# EAGLE schematic Hoverboard JC2015.7.31 (EAGLE 9.6.2)
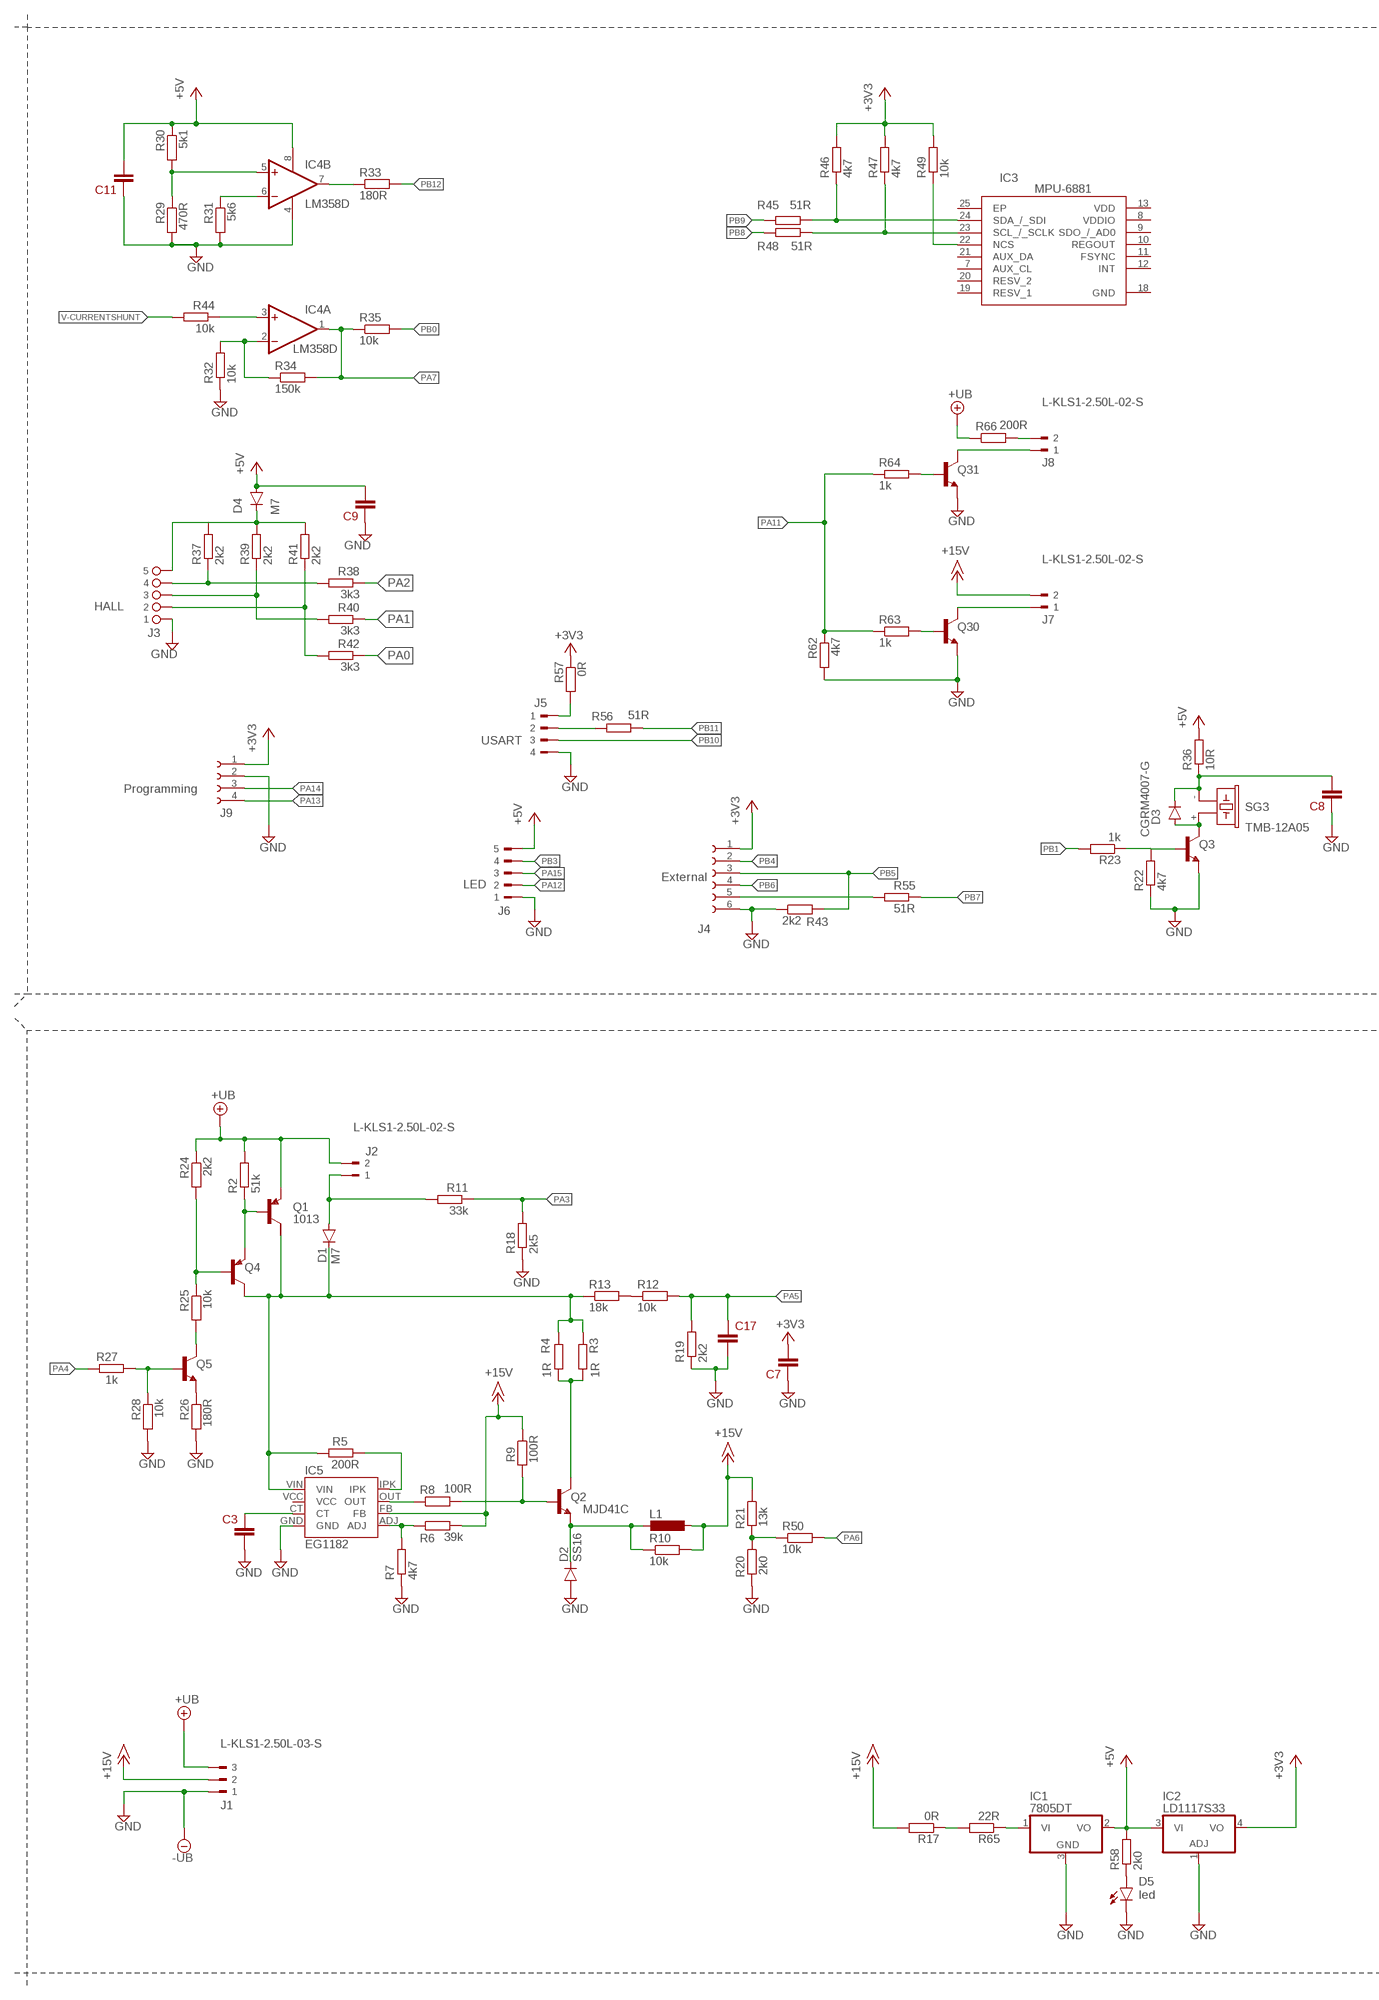
[diagram p0: schematic, sheet 1, part 1 of 2]
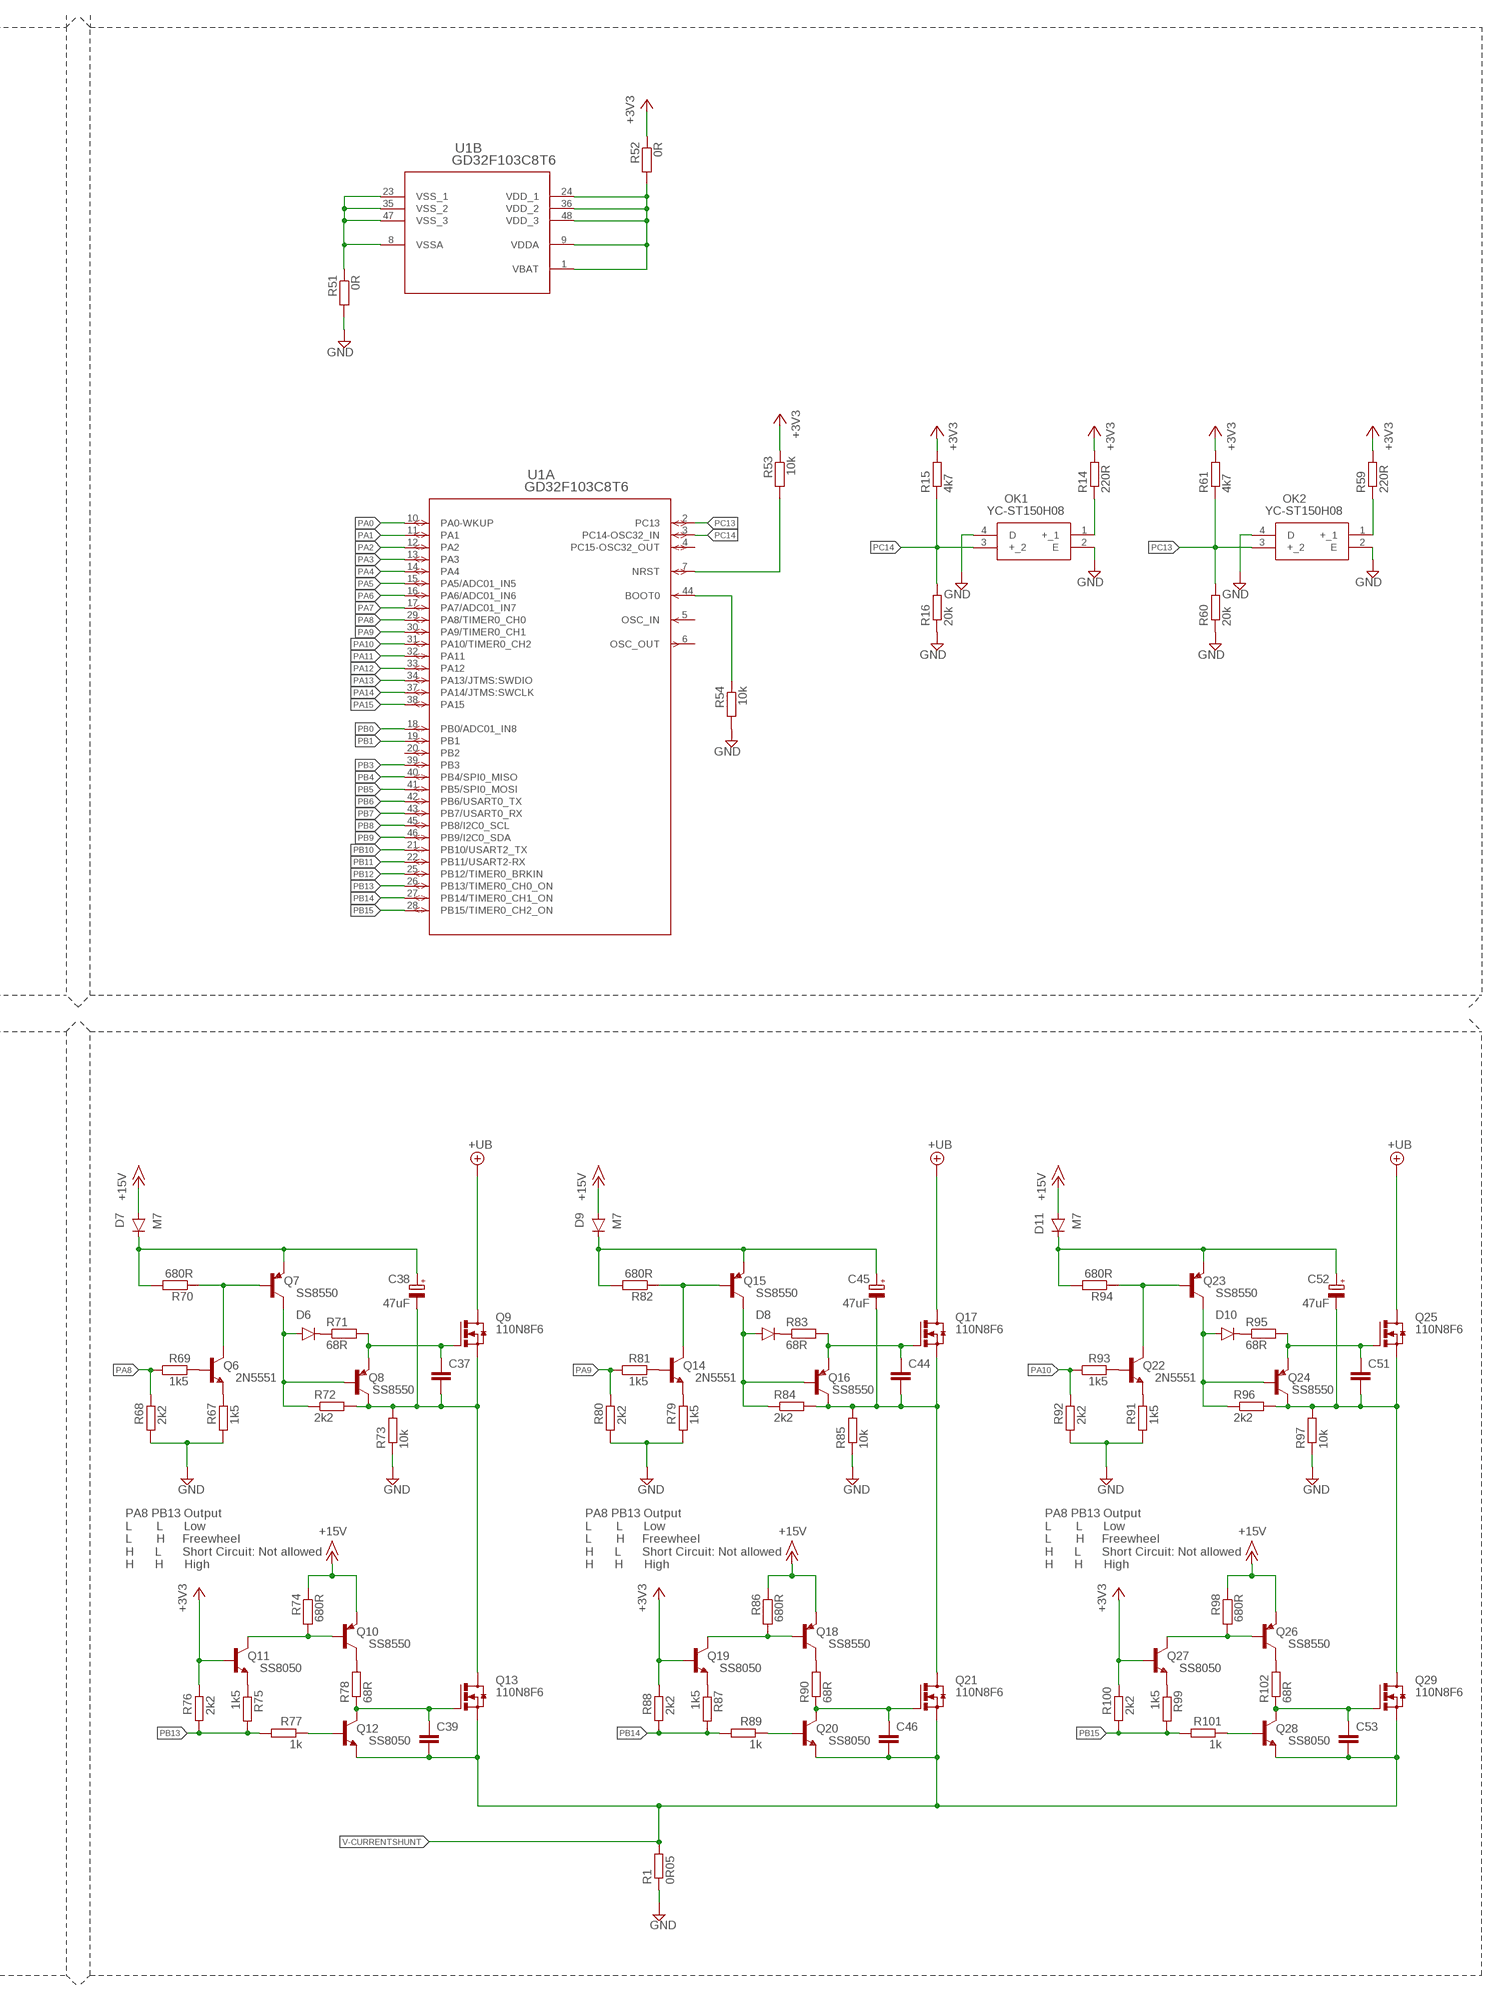
[diagram p1: schematic, sheet 1, part 2 of 2]

## Parts
C3  C-EUC0603  [C0603]
C7  C-EUC0603  [C0603]
C8  C-EUC0603  [C0603]
C9  C-EUC0603  [C0603]
C11  C-EUC0603  [C0603]
C17  C-EUC0603  [C0603]
C37  C-EUC0603  [C0603]
C38  47uF  CPOL-EUE1.8-4  [E1,8-4]
C39  C-EUC0603  [C0603]
C44  C-EUC0603  [C0603]
C45  47uF  CPOL-EUE1.8-4  [E1,8-4]
C46  C-EUC0603  [C0603]
C51  C-EUC0603  [C0603]
C52  47uF  CPOL-EUE1.8-4  [E1,8-4]
C53  C-EUC0603  [C0603]
D1  M7  CGRM4007-G  [SOD-123_MINI-SMA]
D2  SS16  DIODE-DO-214AC  [DO-214AC]
D3  CGRM4007-G  [SOD-123_MINI-SMA]
D4  M7  CGRM4007-G  [SOD-123_MINI-SMA]
D5  led  LG_T679-E1F1-1  [PLCC2]
D6  DIODE-MINIMELF  [MINIMELF]
D7  M7  CGRM4007-G  [SOD-123_MINI-SMA]
D8  DIODE-MINIMELF  [MINIMELF]
D9  M7  CGRM4007-G  [SOD-123_MINI-SMA]
D10  DIODE-MINIMELF  [MINIMELF]
D11  M7  CGRM4007-G  [SOD-123_MINI-SMA]
IC1  7805DT  [TO252]
IC2  LD1117S33  317EMP  [SOT223]
IC3  MPU-6881  [QFN40P300X300X95-25N]
IC4  LM358D  [SO08]
IC5  EG1182  [EG1182]
J1  L-KLS1-2.50L-03-S  [L-KLS1-2.50L-03-S]
J2  L-KLS1-2.50L-02-S  [L-KLS1-2.50L-02-S]
J3  HALL  ST05-1  [ST05-1]
J4  External  FE06-1  [FE06-1]
J5  USART  L-KLS1-2.50L-04-S  [L-KLS1-2.50L-04-S]
J6  LED  L-KLS1-2.50L-05-S  [L-KLS1-2.50L-05-S]
J7  L-KLS1-2.50L-02-S  [L-KLS1-2.50L-02-S]
J8  L-KLS1-2.50L-02-S  [L-KLS1-2.50L-02-S]
J9  Programming  FE04-1  [FE04-1]
L1  L-EU6000-XXX-RC  [6000-XXXX-RC]
OK1  YC-ST150H08  [YC-ST150H08]
OK2  YC-ST150H08  [YC-ST150H08]
Q1  1013  PNP-TRANSISTIOR-2COLSOT89  [SOT89]
Q2  MJD41C  MJD31C  [DPAK]
Q3  MMBT5551LT1-NPN-SOT23-BEC  [SOT23-BEC]
Q4  MMBT540LT1-PNP-SOT23-BEC  [SOT23-BEC]
Q5  MMBT5551LT1-NPN-SOT23-BEC  [SOT23-BEC]
Q6  2N5551  MMBT5551LT1-NPN-SOT23-BEC  [SOT23-BEC]
Q7  SS8550  MMBTA56-SOT23  [SOT23]
Q8  SS8550  MMBTA56-SOT23  [SOT23]
Q9  110N8F6  P110N8F6  [TO220BV]
Q10  SS8550  MMBTA56-SOT23  [SOT23]
Q11  SS8050  MMBT5551LT1-NPN-SOT23-BEC  [SOT23-BEC]
Q12  SS8050  MMBT5551LT1-NPN-SOT23-BEC  [SOT23-BEC]
Q13  110N8F6  P110N8F6  [TO220BV]
Q14  2N5551  MMBT5551LT1-NPN-SOT23-BEC  [SOT23-BEC]
Q15  SS8550  MMBTA56-SOT23  [SOT23]
Q16  SS8550  MMBTA56-SOT23  [SOT23]
Q17  110N8F6  P110N8F6  [TO220BV]
Q18  SS8550  MMBTA56-SOT23  [SOT23]
Q19  SS8050  MMBT5551LT1-NPN-SOT23-BEC  [SOT23-BEC]
Q20  SS8050  MMBT5551LT1-NPN-SOT23-BEC  [SOT23-BEC]
Q21  110N8F6  P110N8F6  [TO220BV]
Q22  2N5551  MMBT5551LT1-NPN-SOT23-BEC  [SOT23-BEC]
Q23  SS8550  MMBTA56-SOT23  [SOT23]
Q24  SS8550  MMBTA56-SOT23  [SOT23]
Q25  110N8F6  P110N8F6  [TO220BV]
Q26  SS8550  MMBTA56-SOT23  [SOT23]
Q27  SS8050  MMBT5551LT1-NPN-SOT23-BEC  [SOT23-BEC]
Q28  SS8050  MMBT5551LT1-NPN-SOT23-BEC  [SOT23-BEC]
Q29  110N8F6  P110N8F6  [TO220BV]
Q30  MMBT5551LT1-NPN-SOT23-BEC  [SOT23-BEC]
Q31  MMBT5551LT1-NPN-SOT23-BEC  [SOT23-BEC]
R1  0R05  R-EU_R2512  [R2512]
R2  51k  R-EU_R0805  [R0805]
R3  1R  R-EU_R1206  [R1206]
R4  1R  R-EU_R1206  [R1206]
R5  200R  R-EU_R0805  [R0805]
R6  39k  R-EU_R0805  [R0805]
R7  4k7  R-EU_R0805  [R0805]
R8  100R  R-EU_R0805  [R0805]
R9  100R  R-EU_R0805  [R0805]
R10  10k  R-EU_R0805  [R0805]
R11  33k  R-EU_R0603  [R0603]
R12  10k  R-EU_R0805  [R0805]
R13  18k  R-EU_R0805  [R0805]
R14  220R  R-EU_R0805  [R0805]
R15  4k7  R-EU_R0805  [R0805]
R16  20k  R-EU_R0805  [R0805]
R17  0R  R-EU_R1206  [R1206]
R18  2k5  R-EU_R0805  [R0805]
R19  2k2  R-EU_R0805  [R0805]
R20  2k0  R-EU_R0805  [R0805]
R21  13k  R-EU_R0805  [R0805]
R22  4k7  R-EU_R0805  [R0805]
R23  1k  R-EU_R0805  [R0805]
R24  2k2  R-EU_R0805  [R0805]
R25  10k  R-EU_R0805  [R0805]
R26  180R  R-EU_R0805  [R0805]
R27  1k  R-EU_R0805  [R0805]
R28  10k  R-EU_R0805  [R0805]
R29  470R  R-EU_R0805  [R0805]
R30  5k1  R-EU_R0805  [R0805]
R31  5k6  R-EU_R0805  [R0805]
R32  10k  R-EU_R0805  [R0805]
R33  180R  R-EU_R0805  [R0805]
R34  150k  R-EU_R0805  [R0805]
R35  10k  R-EU_R0805  [R0805]
R36  10R  R-EU_R0805  [R0805]
R37  2k2  R-EU_R0805  [R0805]
R38  3k3  R-EU_R0805  [R0805]
R39  2k2  R-EU_R0805  [R0805]
R40  3k3  R-EU_R0805  [R0805]
R41  2k2  R-EU_R0805  [R0805]
R42  3k3  R-EU_R0805  [R0805]
R43  2k2  R-EU_R0805  [R0805]
R44  10k  R-EU_R0805  [R0805]
R45  51R  R-EU_R0805  [R0805]
R46  4k7  R-EU_R0805  [R0805]
R47  4k7  R-EU_R0805  [R0805]
R48  51R  R-EU_R0805  [R0805]
R49  10k  R-EU_R0805  [R0805]
R50  10k  R-EU_R0805  [R0805]
R51  0R  R-EU_R0805  [R0805]
R52  0R  R-EU_R0805  [R0805]
R53  10k  R-EU_R0805  [R0805]
R54  10k  R-EU_R0805  [R0805]
R55  51R  R-EU_R0805  [R0805]
R56  51R  R-EU_R0805  [R0805]
R57  0R  R-EU_R0805  [R0805]
R58  2k0  R-EU_R0805  [R0805]
R59  220R  R-EU_R0805  [R0805]
R60  20k  R-EU_R0805  [R0805]
R61  4k7  R-EU_R0805  [R0805]
R62  4k7  R-EU_R0805  [R0805]
R63  1k  R-EU_R0805  [R0805]
R64  1k  R-EU_R0805  [R0805]
R65  22R  R-EU_R2512  [R2512]
R66  200R  R-EU_R2512  [R2512]
R67  1k5  R-EU_R0805  [R0805]
R68  2k2  R-EU_R0805  [R0805]
R69  1k5  R-EU_R0805  [R0805]
R70  680R  R-EU_R0805  [R0805]
R71  68R  R-EU_R0805  [R0805]
R72  2k2  R-EU_R0805  [R0805]
R73  10k  R-EU_R0805  [R0805]
R74  680R  R-EU_R0805  [R0805]
R75  1k5  R-EU_R0805  [R0805]
R76  2k2  R-EU_R0805  [R0805]
R77  1k  R-EU_R0805  [R0805]
R78  68R  R-EU_R0805  [R0805]
R79  1k5  R-EU_R0805  [R0805]
R80  2k2  R-EU_R0805  [R0805]
R81  1k5  R-EU_R0805  [R0805]
R82  680R  R-EU_R0805  [R0805]
R83  68R  R-EU_R0805  [R0805]
R84  2k2  R-EU_R0805  [R0805]
R85  10k  R-EU_R0805  [R0805]
R86  680R  R-EU_R0805  [R0805]
R87  1k5  R-EU_R0805  [R0805]
R88  2k2  R-EU_R0805  [R0805]
R89  1k  R-EU_R0805  [R0805]
R90  68R  R-EU_R0805  [R0805]
R91  1k5  R-EU_R0805  [R0805]
R92  2k2  R-EU_R0805  [R0805]
R93  1k5  R-EU_R0805  [R0805]
R94  680R  R-EU_R0805  [R0805]
R95  68R  R-EU_R0805  [R0805]
R96  2k2  R-EU_R0805  [R0805]
R97  10k  R-EU_R0805  [R0805]
R98  680R  R-EU_R0805  [R0805]
R99  1k5  R-EU_R0805  [R0805]
R100  2k2  R-EU_R0805  [R0805]
R101  1k  R-EU_R0805  [R0805]
R102  68R  R-EU_R0805  [R0805]
SG3  TMB-12A05  TMB-12A  [TMB12A]
U1  GD32F103C8T6  STM32F103C8T6  [LQFP48-7X7MM]

## Nets
+3V3: C7.2 IC2.4(VO) J4.1 J9.1 Q11.B Q19.B Q27.B R14.2 R15.2 R46.2 R47.2 R49.2 R52.1 R53.1 R57.1 R59.2 R61.2 R76.2 R88.2 R100.2
+5V: C9.2 C11.2 D4.A IC1.2(VO) IC2.3(VI) IC4.8(P:V+) J6.5 R30.1 R36.2 R58.2
+15V: D7.A D9.A D11.A IC5.FB J1.2 J7.2 L1.1 Q10.2(E) Q18.2(E) Q26.2(E) R6.2 R9.1 R10.2 R17.2 R21.1 R74.1 R86.1 R98.1
+UB: J1.3 J2.2 Q1.3(E) Q9.D Q17.D Q25.D R2.2 R24.1 R66.1
GND: C3.2 C7.1 C8.1 C9.1 C11.1 C17.2 D2.A D5.C IC1.3(GND) IC2.1(ADJ) IC4.4(P:V-) IC5.GND J1.1 J3.1 J4.6 J5.4 J6.1 J9.2 OK1.2(E) OK1.4(D) OK2.2(E) OK2.4(D) Q3.E Q30.E Q31.E R1.1 R7.1 R16.1 R18.1 R19.1 R20.2 R22.1 R26.2 R28.2 R29.2 R31.2 R32.1 R43.1 R51.2 R54.2 R60.1 R62.2 R67.1 R68.1 R73.1 R79.1 R80.1 R85.1 R91.1 R92.1 R97.1 ; supply symbol labelled -UB
N$1: D1.A J2.1 R11.2
N$2: IC3.24(SDA_/_SDI) R45.1 R46.1
N$3: D1.C IC5.VIN Q4.C R3.1 R4.1 R5.2 R13.1
N$4: R12.1 R13.2
N$5: Q1.2(C)
N$6: Q1.1(B) Q4.E R2.1
N$7: Q4.B R24.2 R25.1
N$8: Q14.E R79.2
N$9: IC5.ADJ R6.1 R7.2
N$10: Q2.1(B) R8.2 R9.2
N$11: IC5.OUT R8.1
N$12: C3.1 IC5.CT
N$13: Q2.4(C) R3.2 R4.2
N$14: D2.C L1.2 Q2.3(E) R10.1
N$15: IC1.1(VI) R65.1
N$16: IC5.IPK R5.1
N$17: OK1.1(+_1) R14.1
N$19: R17.1 R65.2
N$20: Q14.B R81.2
N$21: R20.1 R21.2 R50.1
N$22: IC3.23(SCL_/_SCLK) R47.1 R48.1
N$23: Q3.B R22.2 R23.1
N$24: Q5.C R25.2
N$25: D3.A Q3.C SG3.+
N$26: C8.2 D3.C R36.1 SG3.-
N$27: Q5.E R26.1
N$28: Q5.B R27.1 R28.1
N$29: IC3.22(NCS) R49.1
N$30: IC4.5(B:+IN) R29.1 R30.2
N$31: IC4.6(B:-IN) R31.1
N$33: IC4.2(A:-IN) R32.2 R34.1
N$34: R51.1 U1.8(B:VSSA) U1.23(B:VSS_1) U1.35(B:VSS_2) U1.47(B:VSS_3)
N$35: IC4.3(A:+IN) R44.1
N$36: IC4.7(B:OUT) R33.1
N$37: R52.2 U1.1(B:VBAT) U1.9(B:VDDA) U1.24(B:VDD_1) U1.36(B:VDD_2) U1.48(B:VDD_3)
N$38: R53.2 U1.7(A:NRST)
N$39: J3.4 R37.1 R38.2
N$40: D4.C J3.5 R37.2 R39.2 R41.2
N$41: R54.1 U1.44(A:BOOT0)
N$42: J3.3 R39.1 R40.2
N$43: J8.2 R66.2
N$44: J3.2 R41.1 R42.2
N$45: J4.5 R55.2
N$46: J5.1 R57.2
N$47: D5.A R58.1
N$48: OK2.1(+_1) R59.1
N$50: J7.1 Q30.C
N$51: Q30.B R63.2
N$52: J8.1 Q31.C
N$53: Q31.B R64.1
N$55: Q6.E R67.2
N$56: Q6.B R69.2
N$57: Q6.C Q7.1(B) R70.1
N$58: C38.+ D7.C Q7.2(E) R70.2
N$59: D6.A Q7.3(C) Q8.1(B) R72.1
N$60: D6.C R71.1
N$61: C37.2 Q8.2(E) Q9.G R71.2
N$62: C37.1 C38.- Q8.3(C) Q9.S Q13.D R72.2 R73.2
N$63: Q10.1(B) Q11.C R74.2
N$64: Q14.C Q15.1(B) R82.1
N$65: Q10.3(C) R78.2
N$66: C39.2 Q12.C Q13.G R78.1
N$67: C45.+ D9.C Q15.2(E) R82.2
N$68: D8.A Q15.3(C) Q16.1(B) R84.1
N$69: Q11.E R75.1
N$70: Q12.B R77.1
N$71: D8.C R83.1
N$72: C44.2 Q16.2(E) Q17.G R83.2
N$73: C44.1 C45.- Q16.3(C) Q17.S Q21.D R84.2 R85.2
N$74: Q18.1(B) Q19.C R86.2
N$75: Q18.3(C) R90.2
N$76: C46.2 Q20.C Q21.G R90.1
N$77: Q19.E R87.1
N$78: Q20.B R89.1
N$79: Q22.E R91.2
N$80: Q22.B R93.2
N$81: Q22.C Q23.1(B) R94.1
N$82: C52.+ D11.C Q23.2(E) R94.2
N$83: D10.A Q23.3(C) Q24.1(B) R96.1
N$84: D10.C R95.1
N$85: C51.2 Q24.2(E) Q25.G R95.2
N$86: C51.1 C52.- Q24.3(C) Q25.S Q29.D R96.2 R97.2
N$87: Q26.1(B) Q27.C R98.2
N$88: Q26.3(C) R102.2
N$89: C53.2 Q28.C Q29.G R102.1
N$90: Q27.E R99.1
N$91: Q28.B R101.1
N$92: J5.2 R56.2
PA0: R42.1 U1.10(A:PA0-WKUP)
PA1: R40.1 U1.11(A:PA1)
PA2: R38.1 U1.12(A:PA2)
PA3: R11.1 R18.2 U1.13(A:PA3)
PA4: R27.2 U1.14(A:PA4)
PA5: C17.1 R12.2 R19.2 U1.15(A:PA5/ADC01_IN5)
PA6: R50.2 U1.16(A:PA6/ADC01_IN6)
PA7: IC4.1(A:OUT) R34.2 R35.1 U1.17(A:PA7/ADC01_IN7)
PA8: R68.2 R69.1 U1.29(A:PA8/TIMER0_CH0)
PA9: R80.2 R81.1 U1.30(A:PA9/TIMER0_CH1)
PA10: R92.2 R93.1 U1.31(A:PA10/TIMER0_CH2)
PA11: R62.1 R63.1 R64.2 U1.32(A:PA11)
PA12: J6.2 U1.33(A:PA12)
PA13: J9.4 U1.34(A:PA13/JTMS:SWDIO)
PA14: J9.3 U1.37(A:PA14/JTMS:SWCLK)
PA15: J6.3 U1.38(A:PA15)
PB0: R35.2 U1.18(A:PB0/ADC01_IN8)
PB1: R23.2 U1.19(A:PB1)
PB3: J6.4 U1.39(A:PB3)
PB4: J4.2 U1.40(A:PB4/SPI0_MISO)
PB5: J4.3 R43.2 U1.41(A:PB5/SPI0_MOSI)
PB6: J4.4 U1.42(A:PB6/USART0_TX)
PB7: R55.1 U1.43(A:PB7/USART0_RX)
PB8: R48.2 U1.45(A:PB8/I2C0_SCL)
PB9: R45.2 U1.46(A:PB9/I2C0_SDA)
PB10: J5.3 U1.21(A:PB10/USART2_TX)
PB11: R56.1 U1.22(A:PB11/USART2-RX)
PB12: R33.2 U1.25(A:PB12/TIMER0_BRKIN)
PB13: R75.2 R76.1 R77.2 U1.26(A:PB13/TIMER0_CH0_ON)
PB14: R87.2 R88.1 R89.2 U1.27(A:PB14/TIMER0_CH1_ON)
PB15: R99.2 R100.1 R101.2 U1.28(A:PB15/TIMER0_CH2_ON)
PC13: OK2.3(+_2) R60.2 R61.1 U1.2(A:PC13)
PC14: OK1.3(+_2) R15.1 R16.2 U1.3(A:PC14-OSC32_IN)
V-CURRENTSHUNT: C39.1 C46.1 C53.1 Q12.E Q13.S Q20.E Q21.S Q28.E Q29.S R1.2 R44.2
Unconnected: IC3.7(AUX_CL) IC3.8(VDDIO) IC3.9(SDO_/_AD0) IC3.10(REGOUT) IC3.11(FSYNC) IC3.12(INT) IC3.13(VDD) IC3.18(GND) IC3.19(RESV_1) IC3.20(RESV_2) IC3.21(AUX_DA) IC3.25(EP) IC5.VCC Q1.2@1(C/) U1.4(A:PC15-OSC32_OUT) U1.5(A:OSC_IN) U1.6(A:OSC_OUT) U1.20(A:PB2)

## Notes on the sheet
- PA8 PB13 Output
  L       L      Low
  L       H     Freewheel
  H      L      Short Circuit: Not allowed
  H      H      High
- PA8 PB13 Output
  L       L      Low
  L       H     Freewheel
  H      L      Short Circuit: Not allowed
  H      H      High
- PA8 PB13 Output
  L       L      Low
  L       H     Freewheel
  H      L      Short Circuit: Not allowed
  H      H      High

## Library data of the parts
C3 C7-C9 C11 C17 C37 C39 C44 C46 C51 C53 = rcl:C-EU: CAPACITOR, European symbol; SPICEPREFIX: C
C38 C45 C52 = rcl:CPOL-EU: POLARIZED CAPACITOR, European symbol; SPICEPREFIX: C
D1 D3 D4 D7 D9 D11 = diode:CGRM400*-G: Molded plasitc,JEDEC SOD-123/Mini SMA Source: Comchip CGRM4001-G.pdf
D2 D6 D8 D10 = diode:DIODE-: DIODE
D5 = led:*_T679-?-1: LC TOPLED® Low Current LED Source: http://catalog.osram-os.com .. LG_LS_LY_T679_OBS.pdf; COLOR: green
IC1 = linear:78*: Positive VOLTAGE REGULATOR Source: http://cache.national.com/ds/LM/LM78L05.pdf http://www.fairchildsemi.com/ds/LM/LM7805.pdf
IC2 = linear:*317: Positive VOLTAGE REGULATOR
IC3 = SamacSys_Parts:MPU-6881: IMUs - Inertial Measurement Units 6-Axis MEMS MotionTracking Device with DMP Source: Datasheet <https://www.semiconductorstore.com/Images/Items/Uploaded/0236/mpu-6881-a7be4.pdf>; ARROW_PART_NUMBER: MPU-6881; ARROW_PRICE-STOCK: https://www.arrow.com/en/products/mpu-6881/invensense?region=nac; DESCRIPTION: IMUs - Inertial Measurement Units 6-Axis MEMS MotionTracking Device with DMP; HEIGHT: 0.95mm; MANUFACTURER_NAME: TDK; MANUFACTURER_PART_NUMBER: MPU-6881; MOUSER_PART_NUMBER: 410-MPU-6881; MOUSER_PRICE-STOCK: https://www.mouser.com/Search/Refine.aspx?Keyword=410-MPU-6881
IC4 = linear:LM358: OP AMP also LM158; LM258; LM2904 Source: http://cache.national.com/ds/LM/LM158.pdf
IC5 = JohMah:EG1182
J1 = JohMah:L-KLS1-2.50L-03-S
J2 J7 J8 = JohMah:L-KLS1-2.50L-02-S
J3 = JohMah:ST05-1
J4 = JohMah:FE06-1: FEMALE HEADER
J5 = JohMah:L-KLS1-2.50L-04-S
J6 = JohMah:L-KLS1-2.50L-05-S
J9 = JohMah:FE04-1: FEMALE HEADER
L1 = rcl:L-EU: INDUCTOR, European symbol; SPICEPREFIX: L
OK1 OK2 = JohMah:YC-ST150H08: Photointerrupter Transmissive 3.1mm Source: Datasheet <http://uk.rs-online.com/web/p/products/7085538>; ARROW_PART_NUMBER: TCST1103; ARROW_PRICE-STOCK: https://www.arrow.com/en/products/tcst1103/vishay; DESCRIPTION: Photointerrupter Transmissive 3.1mm; HEIGHT: mm; MANUFACTURER_NAME: Vishay; MANUFACTURER_PART_NUMBER: TCST1103; MOUSER_PART_NUMBER: 782-TCST1103; MOUSER_PRICE-STOCK: https://www.mouser.co.uk/ProductDetail/Vishay-Semiconductors/TCST1103?qs=wiO5jjUX9wvR71xzvYTPYQ%3D%3D
Q1 = semicon-smd-ipc:PNP-TRANSISTIOR-2COL: PNP TRANSISTOR 2 colletor pins
Q2 = transistor-neu-to92:MJD31*: Complementary Power Transistors
Q3 Q5 Q6 Q11 Q12 Q14 Q19 Q20 Q22 Q27 Q28 Q30 Q31 = transistor:*-NPN-: NPN Transistror BF959 corrected 2008.03.06
Q4 = transistor:*-PNP-: PNP Transistror
Q7 Q8 Q10 Q15 Q16 Q18 Q23 Q24 Q26 = transistor-pnp:*-?: PNP Transistor
Q9 Q13 Q17 Q21 Q25 Q29 = JohMah:P110N8F6: N - CHANNEL ENHANCEMENT MODE POWER MOS TRANSISTOR
R1-R102 = rcl:R-EU_: RESISTOR, European symbol; SPICEPREFIX: R
SG3 = JohMah:TMB-12A: BUZZER; OC_FARNELL: unknown; OC_NEWARK: unknown
U1 = 32F103:STM32F103C8T6; BUILT_BY: EMA_UL_Team; COPYRIGHT: Copyright (C) 2018 Accelerated Designs. All rights reserved; MANUFACTURER_PART_NUMBER: GD32F103C8T6; SOURCELIBRARY: Updates_to_database_2020-10-19; VENDOR: STMicroelectronics